# Altium schematic sheet power.SchDoc
size A4; PageSetup: Record=PageOptions|SelectedOnly=False|CenterHorizontal=True|CenterVertical=True|PrintScale=0.96|XCorrection=1.00|YCorrection=1.00|PrintKind=0|BorderSize=5000000|LeftOffset=0|BottomOffset=0|Orientation=2|PaperLength=1000|PaperWidth=1000|Scale=100|PaperSource=7|PrintQuality=-4|MediaType=1|DitherType=10|PaperKind=A4|PrintScaleMode=1
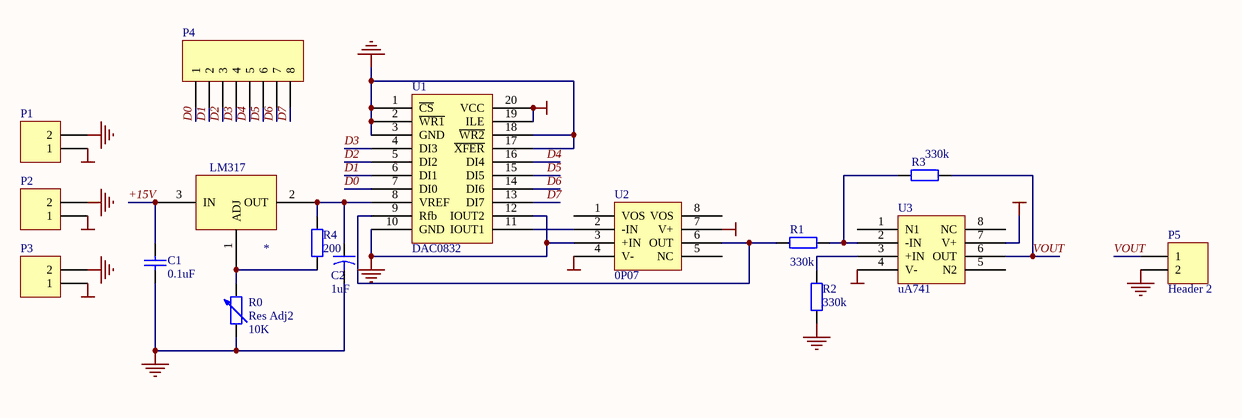
[diagram p0: power.SchDoc]

## Parts
C1  value 0.1uF  [RAD-0.1]
C2  value 1uF  [CAPR5-4X5]
LM317  *  [HDR1X3]
P1  (no value)  [HDR1X2]
P2  (no value)  [HDR1X2]
P3  (no value)  [HDR1X2]
P4  (no value)  [HDR1X8]
P5  Header 2  [HDR1X2]
R0  Res Adj2  value 10K  [AXIAL-0.6]
R1  value 330k  [AXIAL-0.4]
R2  value 330k  [AXIAL-0.4]
R3  value 330k  [AXIAL-0.4]
R4  value 200  [AXIAL-0.4]
U1  DAC0832  [DIP-20]
U2  0P07  [DIP-8]
U3  uA741  [DIP-8]

## Nets
+5V: P1.1 U1.19(ILE) U1.20(VCC)
+15V: C1.2 LM317.3(IN) P2.1 U2.7(V+) U3.7(V+)
-15V: P3.1 U2.4(V-) U3.4(V-)
GND: C1.1 C2.2 P1.2 P2.2 P3.2 P5.2 R0.1 R2.1 U1.1(~{CS}) U1.2(~{WR1}) U1.3(GND) U1.10(GND) U1.12(IOUT2) U1.17(~{XFER}) U1.18(~{WR2}) U2.3(+IN)
D0: P4.1 U1.7(DI0)
D1: P4.2 U1.6(DI1)
D2: P4.3 U1.5(DI2)
D3: P4.4 U1.4(DI3)
D4: P4.5 U1.16(DI4)
D5: P4.6 U1.15(DI5)
D6: P4.7 U1.14(DI6)
D7: P4.8 U1.13(DI7)
VOUT: P5.1 R3.2 U3.6(OUT)
NetC2_1: C2.1 LM317.2(OUT) R4.2 U1.8(VREF)
NetLM317_1: LM317.1(ADJ) R0.2 R4.1
NetR1_1: R1.1 U1.9(Rfb) U2.6(OUT)
NetR1_2: R1.2 R3.1 U3.2(-IN)
NetR2_2: R2.2 U3.3(+IN)
NetU1_11: U1.11(IOUT1) U2.2(-IN)

Not connected (* = marked no-connect by the designer): U2 1(VOS) 5(NC) 8(VOS); U3 1(N1) 5(N2) 8(NC)

## Library data of the parts
C1 = Cap: Capacitor; Published: 8-Jun-2000; LatestRevisionDate: 17-Jul-2002; LatestRevisionNote: Re-released for DXP Platform.; Publisher: Altium Limited
C2 = Cap2: Capacitor; Published: 23-Sep-2002; Publisher: Altium Limited
LM317 = LM317
P1-P3 P5 = Header 2: Header, 2-Pin; LatestRevisionDate: 17-Jul-2002; LatestRevisionNote: Re-released for DXP Platform.; Publisher: Altium Limited
P4 = Header 8: Header, 8-Pin; LatestRevisionDate: 17-Jul-2002; LatestRevisionNote: Re-released for DXP Platform.; Publisher: Altium Limited
R0 = Res Adj2: Variable Resistor; Set Position: 0.5; Published: 8-Jun-2000; LatestRevisionDate: 17-Jul-2002; LatestRevisionNote: Re-released for DXP Platform.; Publisher: Altium Limited
R1-R4 = Res2: Resistor; Published: 8-Jun-2000; LatestRevisionDate: 17-Jul-2002; LatestRevisionNote: Re-released for DXP Platform.; Publisher: Altium Limited
U2 = OP07